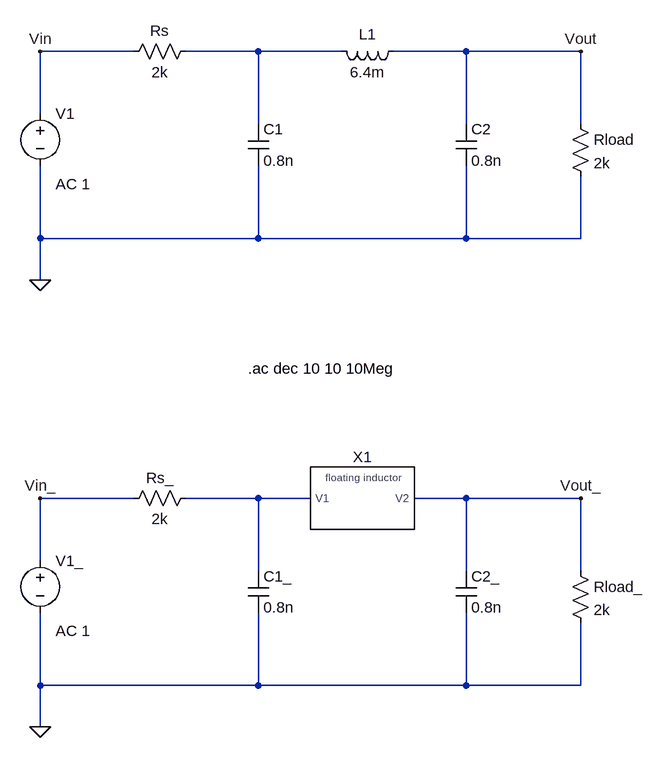
[diagram p0: schematic third_order_Butterworth_filter.asc]
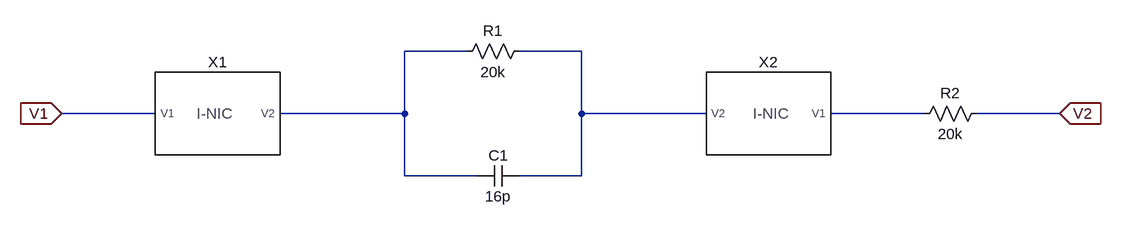
[diagram p1: sub-circuit floating_inductor.asc]
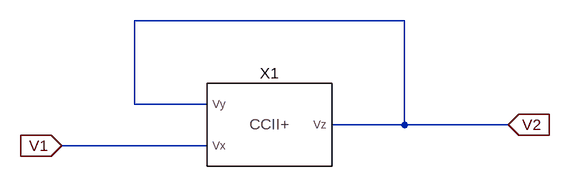
[diagram p2: sub-circuit i-nic.asc]
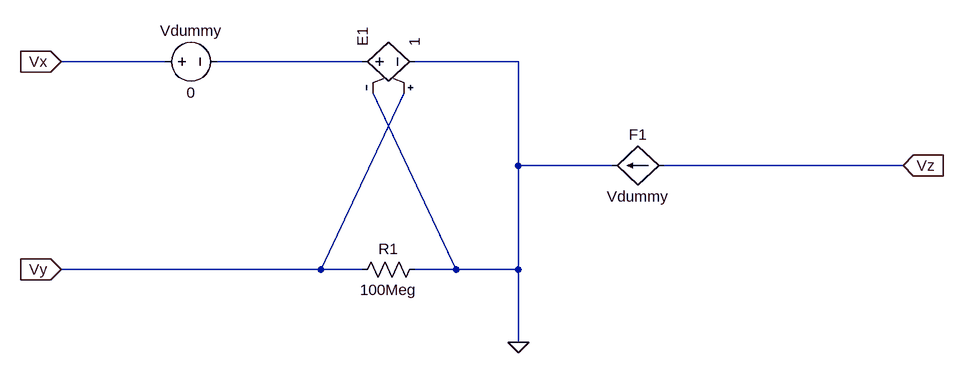
[diagram p3: sub-circuit ccii+.asc]
third_order_Butterworth_filter.asc, the LTspice schematic file:
Version 4
SHEET 1 1512 1144
WIRE 16 64 -128 64
WIRE 208 64 96 64
WIRE 336 64 208 64
WIRE 528 64 416 64
WIRE 704 64 528 64
WIRE -128 160 -128 64
WIRE 208 176 208 64
WIRE 528 176 528 64
WIRE 704 176 704 64
WIRE -128 352 -128 240
WIRE 208 352 208 240
WIRE 208 352 -128 352
WIRE 528 352 528 240
WIRE 528 352 208 352
WIRE 704 352 704 256
WIRE 704 352 528 352
WIRE -128 416 -128 352
WIRE 16 752 -128 752
WIRE 208 752 96 752
WIRE 288 752 208 752
WIRE 528 752 448 752
WIRE 704 752 528 752
WIRE -128 848 -128 752
WIRE 208 864 208 752
WIRE 528 864 528 752
WIRE 704 864 704 752
WIRE -128 1040 -128 928
WIRE 208 1040 208 928
WIRE 208 1040 -128 1040
WIRE 528 1040 528 928
WIRE 528 1040 208 1040
WIRE 704 1040 704 944
WIRE 704 1040 528 1040
WIRE -128 1104 -128 1040
FLAG -128 64 Vin
FLAG 704 64 Vout
FLAG -128 752 Vin_
FLAG 704 752 Vout_
FLAG -128 416 0
FLAG -128 1104 0
SYMBOL res 112 48 R90
WINDOW 0 0 56 VBottom 2
WINDOW 3 32 56 VTop 2
SYMATTR InstName Rs
SYMATTR Value 2k
SYMBOL ind 432 48 R90
WINDOW 0 5 56 VBottom 2
WINDOW 3 32 56 VTop 2
SYMATTR InstName L1
SYMATTR Value 6.4m
SYMBOL cap 192 176 R0
SYMATTR InstName C1
SYMATTR Value 0.8n
SYMBOL cap 512 176 R0
SYMATTR InstName C2
SYMATTR Value 0.8n
SYMBOL res 688 160 R0
SYMATTR InstName Rload
SYMATTR Value 2k
SYMBOL voltage -128 144 R0
WINDOW 123 24 124 Left 2
WINDOW 39 0 0 Left 0
SYMATTR Value2 AC 1
SYMATTR InstName V1
SYMATTR Value ""
SYMBOL res 112 736 R90
WINDOW 0 0 56 VBottom 2
WINDOW 3 32 56 VTop 2
SYMATTR InstName Rs_
SYMATTR Value 2k
SYMBOL cap 192 864 R0
SYMATTR InstName C1_
SYMATTR Value 0.8n
SYMBOL cap 512 864 R0
SYMATTR InstName C2_
SYMATTR Value 0.8n
SYMBOL res 688 848 R0
SYMATTR InstName Rload_
SYMATTR Value 2k
SYMBOL voltage -128 832 R0
WINDOW 123 24 124 Left 2
WINDOW 39 0 0 Left 0
SYMATTR Value2 AC 1
SYMATTR InstName V1_
SYMATTR Value ""
SYMBOL floating_inductor 368 752 R0
SYMATTR InstName X1
TEXT 192 552 Left 2 !.ac dec 10 10 10Meg

floating_inductor.asc, the sub-circuit schematic file:
Version 4
SHEET 1 1512 680
WIRE 432 32 336 32
WIRE 608 32 512 32
WIRE -48 128 -192 128
WIRE 336 128 336 32
WIRE 336 128 144 128
WIRE 608 128 608 32
WIRE 800 128 608 128
WIRE 1136 128 992 128
WIRE 1344 128 1216 128
WIRE 336 224 336 128
WIRE 448 224 336 224
WIRE 608 224 608 128
WIRE 608 224 512 224
FLAG -192 128 V1
IOPIN -192 128 In
FLAG 1344 128 V2
IOPIN 1344 128 In
SYMBOL cap 512 208 R90
WINDOW 0 0 32 VBottom 2
WINDOW 3 32 32 VTop 2
SYMATTR InstName C1
SYMATTR Value 16p
SYMBOL res 528 16 R90
WINDOW 0 0 56 VBottom 2
WINDOW 3 32 56 VTop 2
SYMATTR InstName R1
SYMATTR Value 20k
SYMBOL res 1232 112 R90
WINDOW 0 0 56 VBottom 2
WINDOW 3 32 56 VTop 2
SYMATTR InstName R2
SYMATTR Value 20k
SYMBOL I-NIC 48 128 R0
SYMATTR InstName X1
SYMBOL I-NIC 896 128 M0
SYMATTR InstName X2

i-nic.asc, the sub-circuit schematic file:
Version 4
SHEET 1 880 680
WIRE 416 32 0 32
WIRE 0 160 0 32
WIRE 112 160 0 160
WIRE 416 192 416 32
WIRE 416 192 304 192
WIRE 576 192 416 192
WIRE 112 224 -112 224
FLAG 576 192 V2
IOPIN 576 192 In
FLAG -112 224 V1
IOPIN -112 224 In
SYMBOL CCII+ 208 192 R0
SYMATTR InstName X1

ccii+.asc, the sub-circuit schematic file:
Version 4
SHEET 1 1476 680
WIRE -80 64 -240 64
WIRE 224 64 0 64
WIRE 464 64 304 64
WIRE 464 224 464 64
WIRE 608 224 464 224
WIRE 1056 224 688 224
WIRE 160 384 288 112
WIRE 160 384 -240 384
WIRE 224 384 160 384
WIRE 368 384 240 112
WIRE 368 384 304 384
WIRE 464 384 464 224
WIRE 464 384 368 384
WIRE 464 496 464 384
FLAG -240 64 Vx
IOPIN -240 64 In
FLAG -240 384 Vy
IOPIN -240 384 In
FLAG 1056 224 Vz
IOPIN 1056 224 In
FLAG 464 496 0
SYMBOL voltage -96 64 R270
WINDOW 0 32 56 VTop 2
WINDOW 3 -32 56 VBottom 2
SYMATTR InstName Vdummy
SYMATTR Value 0
SYMBOL f 688 224 R90
WINDOW 0 -32 40 VBottom 2
WINDOW 3 32 40 VTop 2
SYMATTR InstName F1
SYMATTR Value Vdummy
SYMATTR Value2 1
SYMBOL e2 208 64 R270
SYMATTR InstName E1
SYMATTR Value 1
SYMBOL res 320 368 R90
WINDOW 0 0 56 VBottom 2
WINDOW 3 32 56 VTop 2
SYMATTR InstName R1
SYMATTR Value 100Meg

The netlist it stands for:
* third_order_Butterworth_filter.asc
Rs N001 Vin 2k
L1 Vout N001 6.4m
C1 N001 0 0.8n
C2 Vout 0 0.8n
Rload Vout 0 2k
V1 Vin 0 AC 1
Rs_ N002 Vin_ 2k
C1_ N002 0 0.8n
C2_ Vout_ 0 0.8n
Rload_ Vout_ 0 2k
V1_ Vin_ 0 AC 1
XX1 N002 Vout_ floating_inductor

* block symbol definitions
.subckt floating_inductor V1 V2
C1 N002 N001 16p
R1 N002 N001 20k
R2 V2 N003 20k
XX1 V1 N001 i-nic
XX2 N003 N002 i-nic
.ends floating_inductor

.subckt i-nic V1 V2
XX1 V2 V1 V2 ccii+
.ends i-nic

.subckt ccii+ Vy Vx Vz
Vdummy Vx N001 0
F1 Vz 0 Vdummy 1
E1 N001 0 Vy 0 1
R1 0 Vy 100Meg
.ends ccii+

.ac dec 10 10 10Meg
.backanno
.end